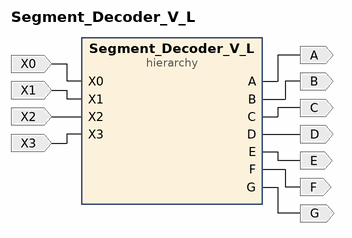
[diagram p0: block diagram of the top level]
# Vivado block design Segment_Decoder_V_L, xc7a35tcpg236-1, Vivado 2018.3
create_bd_design Segment_Decoder_V_L

create_bd_port -dir I X0
create_bd_port -dir I X1
create_bd_port -dir I X2
create_bd_port -dir I X3
create_bd_port -dir O A
create_bd_port -dir O B
create_bd_port -dir O C
create_bd_port -dir O D
create_bd_port -dir O E
create_bd_port -dir O F
create_bd_port -dir O G

create_bd_cell -type hier Segment_Decoder_V_L

# ---- hierarchy /Segment_Decoder_V_L ----
current_bd_instance /Segment_Decoder_V_L
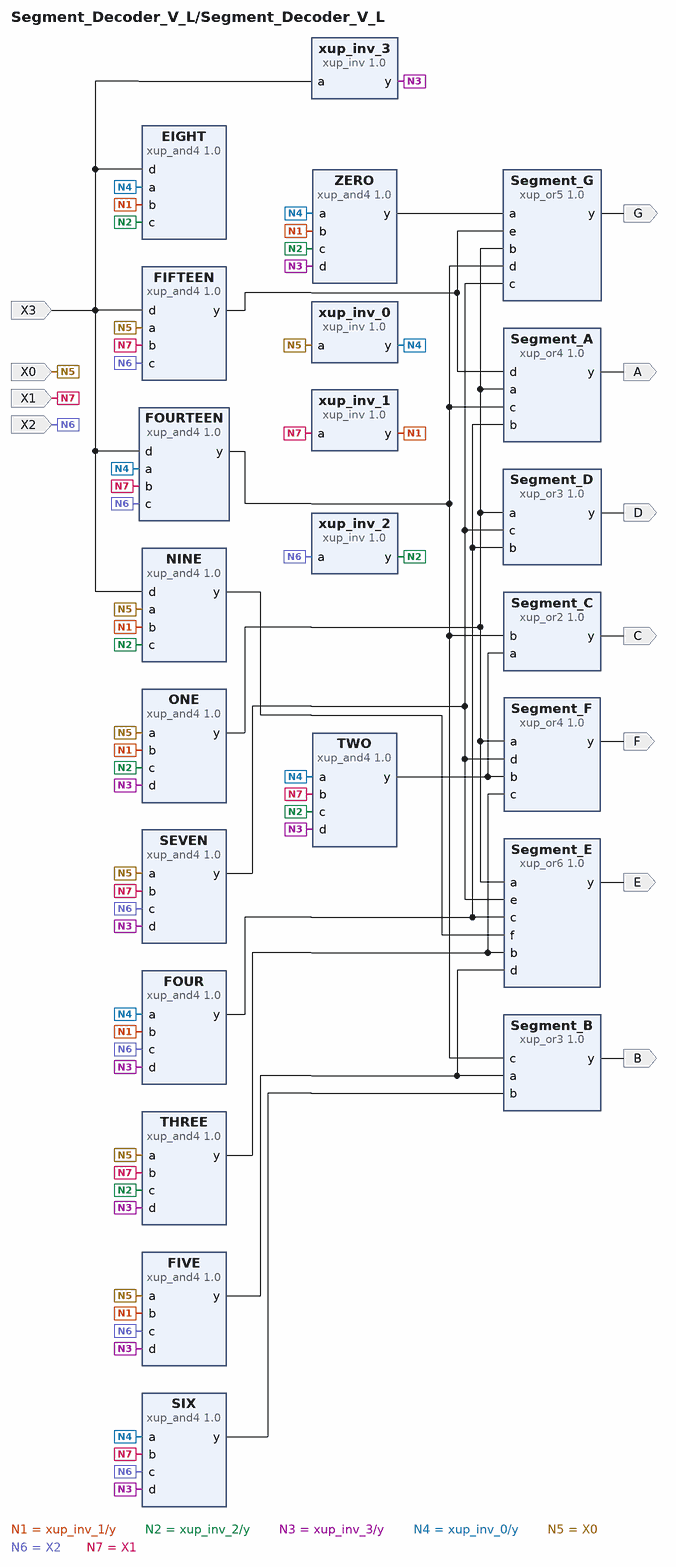
[diagram p1: block diagram inside /Segment_Decoder_V_L]
create_bd_pin -dir I X0
create_bd_pin -dir O G
create_bd_pin -dir I X2
create_bd_pin -dir I X1
create_bd_pin -dir I X3
create_bd_pin -dir O B
create_bd_pin -dir O A
create_bd_pin -dir O D
create_bd_pin -dir O F
create_bd_pin -dir O E
create_bd_pin -dir O C

create_bd_cell -type ip -vlnv xilinx.com:xup:xup_and4:1.0 ONE
set_property -dict {CONFIG.DELAY 0} [get_bd_cells ONE]
create_bd_cell -type ip -vlnv xilinx.com:xup:xup_or5:1.0 Segment_G
set_property -dict {CONFIG.DELAY 0} [get_bd_cells Segment_G]
create_bd_cell -type ip -vlnv xilinx.com:xup:xup_and4:1.0 FOUR
set_property -dict {CONFIG.DELAY 0} [get_bd_cells FOUR]
create_bd_cell -type ip -vlnv xilinx.com:xup:xup_and4:1.0 FOURTEEN
set_property -dict {CONFIG.DELAY 0} [get_bd_cells FOURTEEN]
create_bd_cell -type ip -vlnv xilinx.com:xup:xup_and4:1.0 TWO
set_property -dict {CONFIG.DELAY 0} [get_bd_cells TWO]
create_bd_cell -type ip -vlnv xilinx.com:xup:xup_and4:1.0 FIVE
set_property -dict {CONFIG.DELAY 0} [get_bd_cells FIVE]
create_bd_cell -type ip -vlnv xilinx.com:xup:xup_or3:1.0 Segment_B
set_property -dict {CONFIG.DELAY 0} [get_bd_cells Segment_B]
create_bd_cell -type ip -vlnv xilinx.com:xup:xup_and4:1.0 SEVEN
set_property -dict {CONFIG.DELAY 0} [get_bd_cells SEVEN]
create_bd_cell -type ip -vlnv xilinx.com:xup:xup_or4:1.0 Segment_A
set_property -dict {CONFIG.DELAY 0} [get_bd_cells Segment_A]
create_bd_cell -type ip -vlnv xilinx.com:xup:xup_or3:1.0 Segment_D
set_property -dict {CONFIG.DELAY 0} [get_bd_cells Segment_D]
create_bd_cell -type ip -vlnv xilinx.com:xup:xup_and4:1.0 EIGHT
set_property -dict {CONFIG.DELAY 0} [get_bd_cells EIGHT]
create_bd_cell -type ip -vlnv xilinx.com:xup:xup_or4:1.0 Segment_F
set_property -dict {CONFIG.DELAY 0} [get_bd_cells Segment_F]
create_bd_cell -type ip -vlnv xilinx.com:xup:xup_or6:1.0 Segment_E
set_property -dict {CONFIG.DELAY 0} [get_bd_cells Segment_E]
create_bd_cell -type ip -vlnv xilinx.com:xup:xup_inv:1.0 xup_inv_0
set_property -dict {CONFIG.DELAY 0} [get_bd_cells xup_inv_0]
create_bd_cell -type ip -vlnv xilinx.com:xup:xup_and4:1.0 FIFTEEN
set_property -dict {CONFIG.DELAY 0} [get_bd_cells FIFTEEN]
create_bd_cell -type ip -vlnv xilinx.com:xup:xup_inv:1.0 xup_inv_1
set_property -dict {CONFIG.DELAY 0} [get_bd_cells xup_inv_1]
create_bd_cell -type ip -vlnv xilinx.com:xup:xup_and4:1.0 NINE
set_property -dict {CONFIG.DELAY 0} [get_bd_cells NINE]
create_bd_cell -type ip -vlnv xilinx.com:xup:xup_inv:1.0 xup_inv_2
set_property -dict {CONFIG.DELAY 0} [get_bd_cells xup_inv_2]
create_bd_cell -type ip -vlnv xilinx.com:xup:xup_and4:1.0 THREE
set_property -dict {CONFIG.DELAY 0} [get_bd_cells THREE]
create_bd_cell -type ip -vlnv xilinx.com:xup:xup_and4:1.0 SIX
set_property -dict {CONFIG.DELAY 0} [get_bd_cells SIX]
create_bd_cell -type ip -vlnv xilinx.com:xup:xup_inv:1.0 xup_inv_3
set_property -dict {CONFIG.DELAY 0} [get_bd_cells xup_inv_3]
create_bd_cell -type ip -vlnv xilinx.com:xup:xup_and4:1.0 ZERO
set_property -dict {CONFIG.DELAY 0} [get_bd_cells ZERO]
create_bd_cell -type ip -vlnv xilinx.com:xup:xup_or2:1.0 Segment_C
set_property -dict {CONFIG.DELAY 0} [get_bd_cells Segment_C]

# ---- connections ----

current_bd_instance /Segment_Decoder_V_L
connect_bd_net [get_bd_pins xup_inv_1/y] \
  [get_bd_pins ZERO/b] [get_bd_pins ONE/b] [get_bd_pins FOUR/b] [get_bd_pins FIVE/b] [get_bd_pins EIGHT/b] \
  [get_bd_pins NINE/b]
connect_bd_net [get_bd_pins xup_inv_2/y] \
  [get_bd_pins ZERO/c] [get_bd_pins ONE/c] [get_bd_pins TWO/c] [get_bd_pins THREE/c] [get_bd_pins EIGHT/c] \
  [get_bd_pins NINE/c]
connect_bd_net [get_bd_pins xup_inv_3/y] \
  [get_bd_pins ZERO/d] [get_bd_pins ONE/d] [get_bd_pins TWO/d] [get_bd_pins THREE/d] [get_bd_pins FOUR/d] \
  [get_bd_pins FIVE/d] [get_bd_pins SIX/d] [get_bd_pins SEVEN/d]
connect_bd_net [get_bd_pins ONE/y] \
  [get_bd_pins Segment_A/a] [get_bd_pins Segment_D/a] [get_bd_pins Segment_E/a] [get_bd_pins Segment_F/a] \
  [get_bd_pins Segment_G/b]
connect_bd_net [get_bd_pins ZERO/y] [get_bd_pins Segment_G/a]
connect_bd_net [get_bd_pins SEVEN/y] [get_bd_pins Segment_D/c] [get_bd_pins Segment_E/e] [get_bd_pins Segment_F/d] [get_bd_pins Segment_G/c]
connect_bd_net [get_bd_pins FOURTEEN/y] [get_bd_pins Segment_A/c] [get_bd_pins Segment_B/c] [get_bd_pins Segment_C/b] [get_bd_pins Segment_G/d]
connect_bd_net [get_bd_pins FIFTEEN/y] [get_bd_pins Segment_A/d] [get_bd_pins Segment_G/e]
connect_bd_net [get_bd_pins xup_inv_0/y] \
  [get_bd_pins ZERO/a] [get_bd_pins TWO/a] [get_bd_pins FOUR/a] [get_bd_pins SIX/a] [get_bd_pins EIGHT/a] \
  [get_bd_pins FOURTEEN/a]
connect_bd_net [get_bd_pins FOUR/y] [get_bd_pins Segment_A/b] [get_bd_pins Segment_D/b] [get_bd_pins Segment_E/c]
connect_bd_net [get_bd_pins TWO/y] [get_bd_pins Segment_C/a] [get_bd_pins Segment_F/b]
connect_bd_net [get_bd_pins FIVE/y] [get_bd_pins Segment_B/a] [get_bd_pins Segment_E/d]
connect_bd_net [get_bd_pins SIX/y] [get_bd_pins Segment_B/b]
connect_bd_net [get_bd_pins THREE/y] [get_bd_pins Segment_E/b] [get_bd_pins Segment_F/c]
connect_bd_net [get_bd_pins NINE/y] [get_bd_pins Segment_E/f]
connect_bd_net -net X0_1 [get_bd_pins X0] \
  [get_bd_pins xup_inv_0/a] [get_bd_pins THREE/a] [get_bd_pins FIVE/a] [get_bd_pins SEVEN/a] [get_bd_pins NINE/a] \
  [get_bd_pins FIFTEEN/a] [get_bd_pins ONE/a]
connect_bd_net -net xup_or3_1_y [get_bd_pins Segment_G/y] [get_bd_pins G]
connect_bd_net -net X2_1 [get_bd_pins X2] \
  [get_bd_pins xup_inv_2/a] [get_bd_pins FIVE/c] [get_bd_pins SIX/c] [get_bd_pins SEVEN/c] [get_bd_pins FOURTEEN/c] \
  [get_bd_pins FIFTEEN/c] [get_bd_pins FOUR/c]
connect_bd_net -net X1_1 [get_bd_pins X1] \
  [get_bd_pins xup_inv_1/a] [get_bd_pins TWO/b] [get_bd_pins THREE/b] [get_bd_pins SIX/b] [get_bd_pins SEVEN/b] \
  [get_bd_pins FIFTEEN/b] [get_bd_pins FOURTEEN/b]
connect_bd_net -net X3_1 [get_bd_pins X3] \
  [get_bd_pins xup_inv_3/a] [get_bd_pins EIGHT/d] [get_bd_pins NINE/d] [get_bd_pins FIFTEEN/d] [get_bd_pins FOURTEEN/d]
connect_bd_net -net xup_or2_0_y [get_bd_pins Segment_B/y] [get_bd_pins B]
connect_bd_net -net xup_or3_0_y [get_bd_pins Segment_A/y] [get_bd_pins A]
connect_bd_net -net xup_or3_0_y1 [get_bd_pins Segment_D/y] [get_bd_pins D]
connect_bd_net -net xup_or3_0_y3 [get_bd_pins Segment_F/y] [get_bd_pins F]
connect_bd_net -net xup_or3_0_y2 [get_bd_pins Segment_E/y] [get_bd_pins E]
connect_bd_net -net xup_or2_0_y1 [get_bd_pins Segment_C/y] [get_bd_pins C]

current_bd_instance /
connect_bd_net -net xup_or3_0_y [get_bd_pins Segment_Decoder_V_L/A] [get_bd_ports A]
connect_bd_net -net X0_1 [get_bd_ports X0] [get_bd_pins Segment_Decoder_V_L/X0]
connect_bd_net -net X1_1 [get_bd_ports X1] [get_bd_pins Segment_Decoder_V_L/X1]
connect_bd_net -net X2_1 [get_bd_ports X2] [get_bd_pins Segment_Decoder_V_L/X2]
connect_bd_net -net X3_1 [get_bd_ports X3] [get_bd_pins Segment_Decoder_V_L/X3]
connect_bd_net -net xup_or2_0_y [get_bd_pins Segment_Decoder_V_L/B] [get_bd_ports B]
connect_bd_net -net xup_or2_0_y1 [get_bd_pins Segment_Decoder_V_L/C] [get_bd_ports C]
connect_bd_net -net xup_or3_0_y1 [get_bd_pins Segment_Decoder_V_L/D] [get_bd_ports D]
connect_bd_net -net xup_or3_0_y2 [get_bd_pins Segment_Decoder_V_L/E] [get_bd_ports E]
connect_bd_net -net xup_or3_0_y3 [get_bd_pins Segment_Decoder_V_L/F] [get_bd_ports F]
connect_bd_net -net xup_or3_1_y [get_bd_pins Segment_Decoder_V_L/G] [get_bd_ports G]

validate_bd_design
save_bd_design
